# EAGLE design pc_max30001_brk_v1.0 (EAGLE 9.6.2)
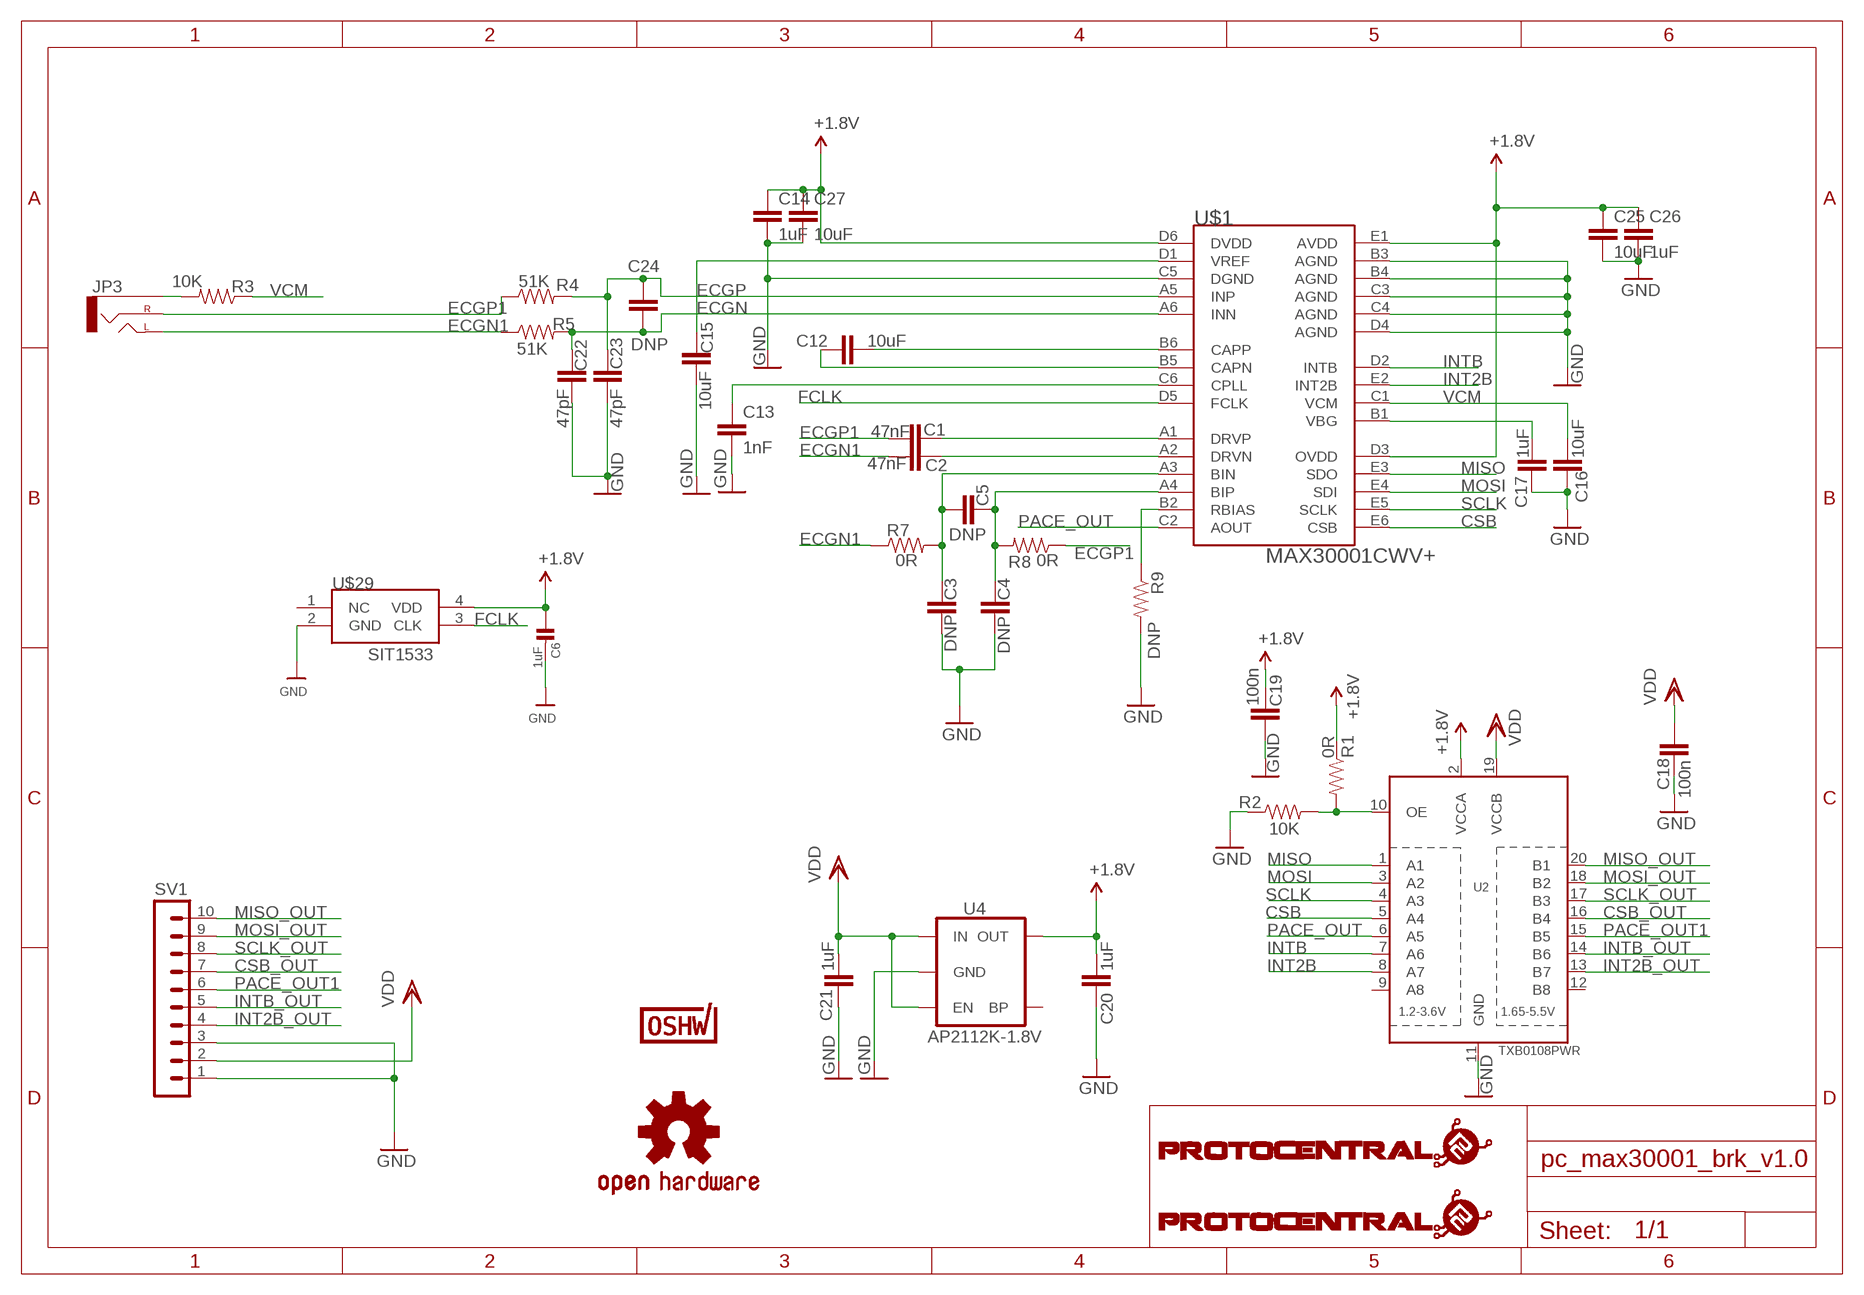
[diagram p0: schematic, sheet 1]

## Parts
C1  47nF  C-EUC0402  [C0402]
C2  47nF  C-EUC0402  [C0402]
C3  DNP  C-EUC0402  [C0402]
C4  DNP  C-EUC0402  [C0402]
C5  DNP  C-EUC0402  [C0402]
C6  1uF  CAP_CERAMIC0402  [0402]
C12  10uF  C-EUC0805  [C0805]
C13  1nF  C-EUC0402  [C0402]
C14  1uF  C-EUC0402  [C0402]
C15  10uF  C-EUC0805  [C0805]
C16  10uF  C-EUC0805  [C0805]
C17  1uF  C-EUC0402  [C0402]
C18  100n  C-EUC0402  [C0402]
C19  100n  C-EUC0402  [C0402]
C20  1uF  C-EUC0805  [C0805]
C21  1uF  C-EUC0805  [C0805]
C22  47pF  C-EUC0402  [C0402]
C23  47pF  C-EUC0402  [C0402]
C24  DNP  C-EUC0402  [C0402]
C25  10uF  C-EUC0805  [C0805]
C26  1uF  C-EUC0402  [C0402]
C27  10uF  C-EUC0805  [C0805]
JP3  AUDIO-JACKSMD2  [AUDIO-JACK-3.5MM-SMD]
R1  0R  RESISTOR0805-RES  [0805]
R2  10K  RESISTOR0805-RES  [0805]
R3  10K  RESISTOR0805-RES  [0805]
R4  51K  RESISTOR0805-RES  [0805]
R5  51K  RESISTOR0805-RES  [0805]
R7  0R  RESISTOR0402-RES  [0402-RES]
R8  0R  RESISTOR0402-RES  [0402-RES]
R9  DNP  RESISTOR0402-RES  [0402-RES]
SV1  MA10-1  [MA10-1]
U2  TXB0108PWR  [TSSOP20]
U4  AP2112K-1.8V  V_REG_LDOSMD  [SOT23-5]
U$1  MAX30001CWV+  [30WLP]
U$3  PROTY-LOGO  [LOGO-PROTY]
U$4  PROTY_LOGO_WITH_TEXT  [PROTY_WITH_TEXT]
U$6  OSHW-LOGOS  [OSHW-LOGO-S]
U$7  CERT-SMALL  [CERT-SMALL-SILK]
U$29  SIT1533  [SIT1533]

## Nets
+1.8V: C6.1 C14.1 C19.2 C20.2 C25.1 C26.1 C27.1 R1.1 U2.2(VCCA) U4.5(OUT) U$1.D3(OVDD) U$1.D6(DVDD) U$1.E1(AVDD) U$29.4(VDD)
CSB: U2.5(A4) U$1.E6(CSB)
CSB_OUT: SV1.7 U2.16(B4)
ECGN: C22.1 C24.2 R5.2 U$1.A6(INN)
ECGN1: C2.1 JP3.TIP(LEFT) R5.1 R7.1
ECGP: C23.1 C24.1 R4.2 U$1.A5(INP)
ECGP1: C1.1 JP3.RING(RIGHT) R4.1 R8.1
FCLK: U$1.D5(FCLK) U$29.3(CLK)
GND: C3.2 C4.2 C6.2 C13.2 C14.2 C15.2 C16.2 C17.2 C18.1 C19.1 C20.1 C21.1 C22.2 C23.2 C25.2 C26.2 C27.2 R2.1 R9.2 SV1.1 SV1.3 U2.11(GND) U4.2(GND) U$1.B3(AGND) U$1.B4(AGND) U$1.C3(AGND) U$1.C4(AGND) U$1.C5(DGND) U$1.D4(AGND) U$29.2(GND)
INT2B: U2.8(A7) U$1.E2(INT2B)
INT2B_OUT: SV1.4 U2.13(B7)
INTB: U2.7(A6) U$1.D2(INTB)
INTB_OUT: SV1.5 U2.14(B6)
MISO: U2.1(A1) U$1.E3(SDO)
MISO_OUT: SV1.10 U2.20(B1)
MOSI: U2.3(A2) U$1.E4(SDI)
MOSI_OUT: SV1.9 U2.18(B2)
N$1: C12.1 U$1.B6(CAPP)
N$2: C1.2 U$1.A1(DRVP)
N$4: C2.2 U$1.A2(DRVN)
N$5: C3.1 C5.1 R7.2 U$1.A3(BIN)
N$6: C4.1 C5.2 R8.2 U$1.A4(BIP)
N$7: R9.1 U$1.B2(RBIAS)
N$10: C13.1 U$1.C6(CPLL)
N$12: C12.2 U$1.B5(CAPN)
N$13: C15.1 U$1.D1(VREF)
N$15: C17.1 U$1.B1(VBG)
N$16: R1.2 R2.2 U2.10(OE)
N$19: JP3.SLEEVE R3.2
PACE_OUT: U2.6(A5) U$1.C2(AOUT)
PACE_OUT1: SV1.6 U2.15(B5)
SCLK: U2.4(A3) U$1.E5(SCLK)
SCLK_OUT: SV1.8 U2.17(B3)
VCM: C16.1 R3.1 U$1.C1(VCM)
VDD: C18.2 C21.2 SV1.2 U2.19(VCCB) U4.1(IN) U4.3(EN)
Unconnected: U2.9(A8) U2.12(B8) U4.4(BP) U$29.1(NC)

## Library data of the parts
C1-C5 C12-C27 = rcl:C-EU: CAPACITOR, European symbol; SPICEPREFIX: C
C6 = microbuilder:CAP_CERAMIC: Ceramic Capacitors 0402 - 0402 Surface Mount Capacitors 16pF 50V 5% [Digikey: 445-4899-2-ND] 18pF 50V 5% [Digikey: 490-1281-2-ND] 22pF 50V 5% [Digikey: 490-1283-2-ND] 68pF 50V 5% [Digikey: 490-1289-2-ND] 0.1uF 10V 10% [Digikey: 490-1318-2-ND] 1.0uF 6.3V 10% [Digikey: 490-1320-2-ND] 0603 - 0603 Surface Mount Capacitors 16 pF 50V 5% [Digikey: 445-5051-2-ND] 22 pF 50V [Digikey: PCC220ACVTR-ND] 33 pF 50V 5% [Digikey: 490-1415-1-ND] 56pF 50V 5% [Digikey: 490-1421-1-ND] 220pF 50V 5% [Digikey: 445-1285-1-ND] 680 pF 50V 2200 pF 50V 5% C0G [Digikey: 445-1297-1-ND] 5600 pF 100V 5% X7R [Digikey: 478-3711-1-ND] 0.1 µF 25V 10% [Digikey: PCC2277TR-ND] 0.22 µF 16V 10% X7R [Digikey: 445-1318-1-ND] 1.0 µF 25V 10% [Digikey: 445-5146-2-ND] 0603 - RF Specific 3pF 250V +/-0.1pF RF [Digikey: 712-1347-1-ND] 18 pF 250V 5% [Digikey: 478-3505-1-ND or 712-1322-1-ND] 56 pF 250V 5% C0G RF [Digikey: 490-4867-1-ND] 68 pF 250V RF [Digikey: 490-4868-1-ND] 0805 - 0805 Surface Mount Capacitors 220 pF 250V 2% RF Ceramic Capacitor [Digikey: 712-1398-1-ND] 1000 pF 50V 2% NP0 Ceramic Capacitor [Digikey: 478-3760-1-ND] 0.1 µF 25V 10% Ceramic Capacitor [Digikey: PCC1828TR-ND] 1.0 µF 16V 10% Ceramic Capacitor[Digikey: 490-1691-2-ND] 10.0 µF 10V 10% Ceramic Capacitor[Digikey: 709-1228-1-ND] 10.0 uF 16V 10% Ceramic Capacitor [Digikey: 478-5165-2-ND] 47 uF 6.3V 20% Ceramic Capacitor [Digikey: 587-1779-1-ND or 399-5506-1-ND] 1206 - 1206 Surface Mount Capacitors 47uF 10V 20% Ceramic Capacitor [Digikey: 490-5528-1-ND or 399-5508-1-ND or 445-6010-1-ND]
JP3 = SparkFun-Connectors:AUDIO-JACK: 3.5mm Audio Jack Simple 3.5mm common PCB mount audio jack. SKU: PRT-08032; PROD_ID: CONN-10353
R1-R5 R7-R9 = SparkFun:RESISTOR: Resistor Basic schematic elements and footprints for 0603, 1206, and PTH resistors.
SV1 = con-lstb:MA10-1: PIN HEADER; OC_FARNELL: unknown; OC_NEWARK: unknown
U2 = adafruit:TXB0108PWR: 8-Bit Bi-Directional Level Shifter 1.2V-3.6V (VCCA) to 1.65V-5.5V (VCCB) bi-directional level shifter with auto direction sensing. Max data rate - VCCA 1.8V: 20Mbps (50ns), VCCA 3.3V: 100Mbps (10ns) Digikey: 296-21527-1-ND
U4 = SparkFun-PowerIC:V_REG_LDO: Voltage Regulator LDO Standard 150mA LDO voltage regulator in SOT-23 layout. Micrel part MIC5205. BP (by-pass) pin is used to lower output noise with 470pF cap.; PROD_ID: VREG-12457
U$1 = circuitects:MAX30001CWV+
U$3 = circuitects:PROTY-LOGO
U$4 = circuitects:PROTY_LOGO_WITH_TEXT
U$6 = SparkFun:OSHW-LOGO: Open Source Hardware Logo This logo indicates the piece of hardware it is found on incorporates a OSHW license and/or adheres to the definition of open source hardware found here: http://freedomdefined.org/OSHW
U$7 = OSHWA:CERT
U$29 = circuitects:SIT1533

## Board
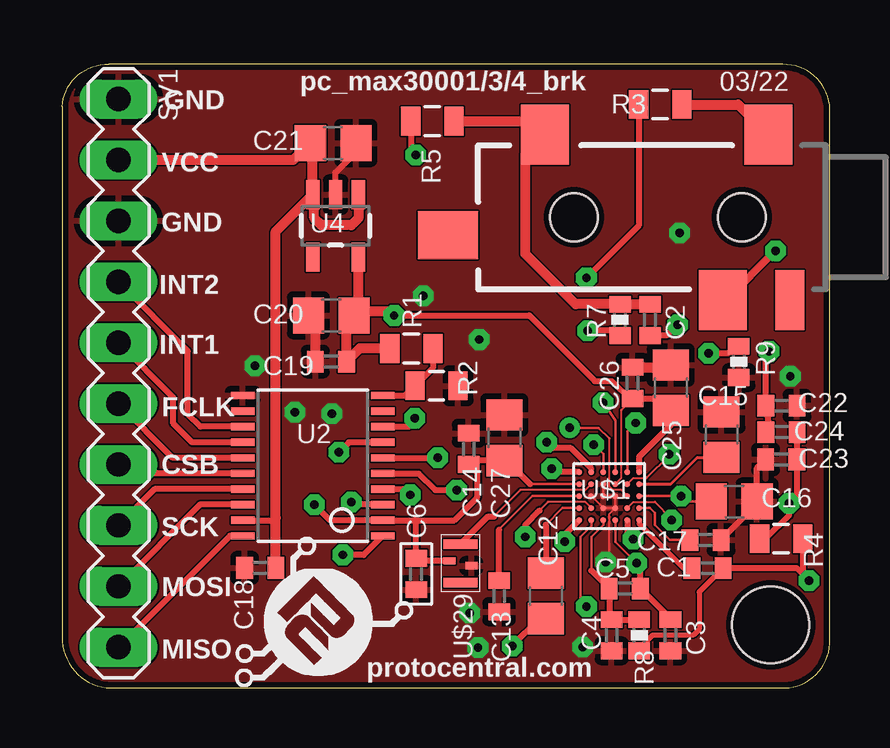
[diagram p1: board, top side]
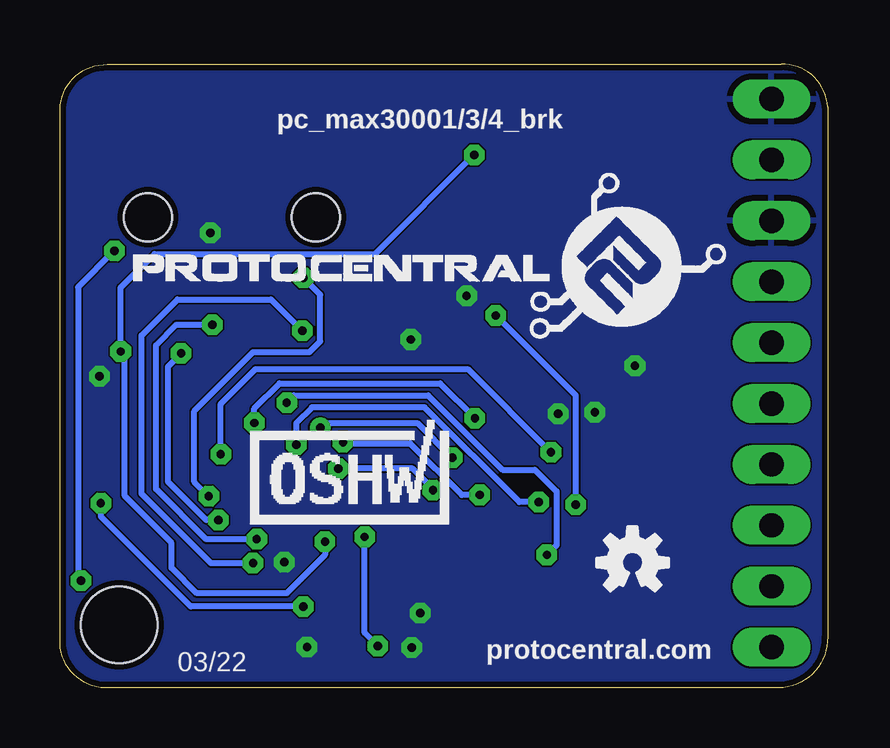
[diagram p2: board, bottom side, seen from below]

Size 32 x 26 mm. Coordinates in mm from the lower left corner, seen from the top.
Outline: 2.03,0 30.13,0 arc90 32,2.03 32,24.13 arc90 30.03,26 1.93,26 arc90 0,24.23 0,2.13 arc90 2.03,0
Copper layers (1*2*15*16): Top 0.035mm / dielectric 1.5mm / Route2 0.035mm / dielectric 0.15mm / Route15 0.035mm / dielectric 0.2mm / Bottom 0.035mm
Design rules "Circuitects-Rules *": minimum track width 2mil, minimum drill 0.05mm, track to track 0.06858125mm, track to pad 0.06858125mm, pad to pad 0.06858125mm, via to via 4mil, smd to smd 4mil, copper to edge 10mil, drill to drill 8mil, minimum pad ring 12mil, minimum via ring 10mil, stop-mask expansion 4mil, vias tented up to drill 25mil, thermal gap 10mil
Holes 3.2 mm at 29.53,2.63

### Footprints (pad centres in the part's own frame; a part is rotated, then mirrored left to right if it is on the bottom)
C0402 = smd 0.7 x 0.9: 1 -0.65,0; 2 0.65,0
0402 = smd 0.7 x 0.9: 1 -0.65,0; 2 0.65,0
C0805 = smd 1.3 x 1.5: 1 -0.95,0; 2 0.95,0
AUDIO-JACK-3.5MM-SMD = smd 2 x 2.5: RING 4.3,3.45; SLEEVE 2.4,-3.45; TIP 11.7,-3.45 | smd 1.2 x 2.5: RSH 1.5,3.45 | smd 2.5 x 2: TSH 15.75,0.75 | hole 2: 3.5,0; 10.5,0
0805 = smd 0.8 x 1.2: 1 -0.9,0; 2 0.9,0
0402-RES = smd 0.7 x 0.9: 1 -0.65,0; 2 0.65,0
MA10-1 = drill 1.016 long: 1 -11.43,0; 2 -8.89,0; 3 -6.35,0; 4 -3.81,0; 5 -1.27,0; 6 1.27,0; 7 3.81,0; 8 6.35,0; 9 8.89,0; 10 11.43,0
TSSOP20 = smd 0.305 x 0.991: 1 -2.925,-2.918; 2 -2.275,-2.918; 3 -1.625,-2.918; 4 -0.975,-2.918; 5 -0.325,-2.918; 6 0.325,-2.918; 7 0.975,-2.918; 8 1.625,-2.918; 9 2.275,-2.918; 10 2.925,-2.918; 11 2.925,2.918; 12 2.275,2.918; 13 1.625,2.918; 14 0.975,2.918; 15 0.325,2.918; 16 -0.325,2.918; 17 -0.975,2.918; 18 -1.625,2.918; 19 -2.275,2.918; 20 -2.925,2.918
SOT23-5 = smd 0.55 x 1.2: 1 -0.95,-1.3; 2 0,-1.3; 3 0.95,-1.3; 4 0.95,1.3; 5 -0.95,1.3
30WLP = smd 0.25 x 0.25: A1 -1.25,1; A2 -0.75,1; A3 -0.25,1; A4 0.25,1; A5 0.75,1; A6 1.25,1; B1 -1.25,0.5; B2 -0.75,0.5; B3 -0.25,0.5; B4 0.25,0.5; B5 0.75,0.5; B6 1.25,0.5; C1 -1.25,0; C2 -0.75,0; C3 -0.25,0; C4 0.25,0; C5 0.75,0; C6 1.25,0; D1 -1.25,-0.5; D2 -0.75,-0.5; D3 -0.25,-0.5; D4 0.25,-0.5; D5 0.75,-0.5; D6 1.25,-0.5; E1 -1.25,-1; E2 -0.75,-1; E3 -0.25,-1; E4 0.25,-1; E5 0.75,-1; E6 1.25,-1
SIT1533 = smd 0.4 x 1.4: 1 -0.8,0; 3 0.8,0 | smd 0.3 x 0.5: 2 -0.1,-0.45; 4 0.1,0.45

### Placement (x,y rotation side)
C1  26.9,5 180 top
C2  24.5,15.35 270 top
C3  25.35,2.2 270 top
C4  22.9,2.2 270 top
C5  23.45,4.15 180 top
C6  14.75,4.75 270 top
C12  20.16,3.84 270 top
C13  18.21,3.83 270 top
C14  16.94,9.97 90 top
C15  27.48,10.56 90 top
C16  28.01,7.77 0 top
C17  26.81,6.17 0 top
C18  8.25,5.01 0 top
C19  11.2,13.61 0 top
C20  11.21,15.53 0 top
C21  11.29,22.72 180 top
C22  29.98,11.77 0 top
C23  29.97,9.53 180 top
C24  29.98,10.67 180 top
C25  25.37,12.52 90 top
C26  23.77,12.72 90 top
C27  18.43,10.43 90 top
JP3  31.83,19.63 180 top
R1  14.55,14.16 0 top
R2  15.6,12.6 180 top
R3  24.93,24.33 0 top
R4  29.97,6.23 180 top
R5  15.43,23.63 180 top
R7  23.25,15.35 270 top
R8  24.05,2.2 90 top
R9  28.2,13.6 270 top
SV1  2.34,13.13 270 top
U2  10.44,9.27 90 top
U4  11.39,19.27 180 top
U$1  22.8,8 180 top
U$3  7.13,-0.07 0 top
U$4  28.93,14.93 0 bottom
U$6  8.13,5.23 0 bottom
U$7  19.93,6.83 0 bottom
U$29  16.6,5.2 90 top

### Tracks (layer width: path | path; a pad name or v marks a point on that pad's centre or on a via)
+1.8V  (via drill 0.35)
  Top 0.076: U$1.D3 23.3,8.75 23.3,11.6
  Top 0.102: U$1.D6 19.5,8.5 | 23.3,11.6 23.7,12 C26.1
  Top 0.254: 19.5,8.5 18.52,9.48 C27.1 | C27.1 17.1,9.48 C14.1 17.3,8.96 17.3,7.95 16.34,7 14.7,7 | C27.1 18.93,9.48 | v13.83,15.53 19.47,15.53 22.2,12.8 22.9,12.8 23.7,12 | C26.1 24.87,12.07 C25.1 25.37,10.97 24.05,9.65 U$1.E1 | v10.5,7.65 11.15,7 U2.2 14.7,7 | U$29.4 14.85,5.3 C6.1 14.75,6.95 14.7,7
  Top 0.406: R1.1 12.4,14.16 C19.2 11.85,15.22 C20.2 12.34,15.71 | 12.34,15.71 13.65,15.71 v13.83,15.53 | 12.34,15.71 U4.5
  Bottom 0.254: v10.5,7.65 10.5,12.2 v13.83,15.53
CSB  (via drill 0.35)
  Top 0.254: U2.5 14.86,8.95 15.55,8.25 v16.45,8.25 | U$1.E6 20.55,9 v20.4,9.15
  Bottom 0.254: v16.45,8.25 16.45,8.3 17.3,9.15 v20.4,9.15
CSB_OUT
  Top 0.254: U2.16 2.71,8.95 SV1.7
ECGN  (via drill 0.35)
  Top 0.254: R5.2 14.53,22.43 v14.73,22.23 | U$1.A6 20.95,6.4 v20.95,6.1 | C24.2 29.47,10.81 C22.1 29.33,13.89 v29.47,14.03
  Bottom 0.254: v14.73,22.22 v14.73,22.23 18.86,18.1 28.06,18.1 29.47,16.69 v29.47,14.03 29.3,13.86 29.3,8 27.35,6.05 27.35,5 26.3,3.95 22.55,3.95 20.95,5.55 v20.95,6.1
ECGN1
  Top 0.406: R5.1 19.58,23.63 JP3.TIP 19.3,22.25 19.3,18.1 21.4,16 R7.1 C2.1
ECGP  (via drill 0.35)
  Top 0.102: U$1.A5 22.05,6.75 21.6,6.3 21.6,3.65 v21.85,3.4
  Top 0.254: C24.1 C23.1 30.62,8.02 v30.3,7.7 30.3,7.2 29.33,6.23 R4.2
  Bottom 0.254: v21.85,3.4 26.55,3.4 30.3,7.15 v30.3,7.7
ECGP1  (via drill 0.35)
  Top 0.2: C1.1 26.55,4 26.55,2.45 26.3,2.2 24.6,2.2 24.05,1.65 R8.1
  Top 0.254: R8.1 24.2,1.7 | 27.4,4.85 C1.1 30.61,5 v31.13,4.48 30.87,4.74 R4.1
  Top 0.305: JP3.RING 27.68,16.18 v29.73,18.23
  Bottom 0.254: v29.73,18.23 31.25,16.71 31.25,4.6 v31.13,4.48
FCLK
  Top 0.076: U$1.D5 21.8,8.25 19.1,8.25
  Top 0.102: 18,7.15 19.1,8.25
  Top 0.254: U$29.3 17.75,7.15 18,7.15
GND  (via drill 0.35)
  Top 0.076: U$1.B3 22.8,7.25 22.8,5.4
  Top 0.102: U$1.D4 U$1.C4 U$1.C3 U$1.B3 | U$1.C5 U$1.B4
  Top 0.134: U$1.B4 U$1.B3
  Top 0.254: U4.2 11.39,21.49 12.24,22.34 C21.1 | C17.2 28.96,7.67 C16.2 28.96,9.17 C23.2 | v22.65,5.25 22.8,5.4
  Top 0.406: C19.1 10.55,15.24 C20.1 | R9.2 28.17,13.08 | C26.2 25.27,13.37 C25.2
  other vias: 8.03,13.43 17.33,1.68 16.98,3.13 11.23,11.43 25.73,18.98 17.38,14.53 15.05,16.35 21.7,1.7 9.7,11.5 30.35,13
  pour Top: 0,26.33 32,26.33 32,0 0,0
  pour Bottom: 0,26 32,26 32,0 0,0
INT2B  (via drill 0.35)
  Top 0.102: U$1.E2 23.55,10.7 v23.9,11.05
  Top 0.254: U2.8 14.45,10.89 v14.7,11.25
  Bottom 0.254: v23.9,11.05 23.9,11.65 22.85,12.7 16.15,12.7 v14.7,11.25
INT2B_OUT
  Top 0.254: U2.13 5.76,10.89 5.23,11.43 5.23,14.05 SV1.4
INTB  (via drill 0.35)
  Top 0.076: U$1.D2 23.8,8.75 24.35,8.75
  Top 0.102: v25.3,9.75 25.3,9.7 24.35,8.75
  Top 0.254: U2.7 11.95,10.24 v11.53,9.83
  Bottom 0.254: v11.53,9.83 15,13.3 23.85,13.3 25.3,11.85 v25.3,9.75
INTB_OUT
  Top 0.254: U2.14 5.42,10.24 4.63,11.03 4.63,12.11 SV1.5
MISO  (via drill 0.35)
  Top 0.102: v22.55,11.9 23.05,11.15 U$1.E3
  Top 0.254: U2.1 12.56,5.55 v11.7,5.55
  Bottom 0.254: v22.55,11.9 22.25,12.2 16.65,12.2 13.55,9.1 12.2,9.1 11.3,8.2 11.3,5.95 v11.7,5.55
MISO_OUT
  Top 0.254: U2.20 6.99,6.34 SV1.10
MOSI  (via drill 0.35)
  Top 0.102: v22.15,10.15 22.55,9.75 U$1.E4
  Top 0.254: U2.3 12.15,7.64 v12.05,7.75
  Bottom 0.254: v12.05,7.75 12.85,7.75 16.8,11.7 21.5,11.7 22.15,11.05 v22.15,10.15
MOSI_OUT
  Top 0.254: U2.18 5.75,7.64 SV1.9
N$1
  Top 0.102: U$1.B6 20.85,7.5 20.16,6.81
  Top 0.254: 20.16,6.81 C12.1
N$2
  Top 0.2: U$1.A1 24.05,6.85 25.9,5 C1.2
N$4  (via drill 0.35)
  Top 0.254: U$1.A2 23.55,6.45 v23.8,6.2 | v25.65,15.15 25.2,14.7 C2.2
  Bottom 0.254: v23.8,6.2 25.9,6.2 28,8.3 28,14.3 27.15,15.15 v25.65,15.15
N$5  (via drill 0.35)
  Top 0.102: U$1.A3 23.05,6.1 v23.95,5.2
  Top 0.254: C3.1 25.35,2.9 C5.1 24.1,5.05 v23.95,5.2 | R7.2 23.05,14.9 v21.9,14.9
  Bottom 0.254: v23.95,5.2 25.7,5.2 28.6,8.1 28.6,14.7 27.1,16.2 23.2,16.2 v21.9,14.9
N$6
  Top 0.102: U$1.A4 22.55,6.8 22.05,6.3 22.05,4.9
  Top 0.254: 22.05,4.9 C5.2 22.8,2.95 C4.1 R8.2
N$7  (via drill 0.35)
  Top 0.076: U$1.B2 23.8,7.75 24.7,7.75
  Top 0.1: U$1.B2 23.6,7.5
  Top 0.102: v25.4,7 25.4,7.05 24.7,7.75
  Top 0.254: R9.1 27.75,13.95 v26.95,13.95
  Bottom 0.254: v25.4,7 25.9,7 27.5,8.6 27.5,13.4 v26.95,13.95
N$10
  Top 0.102: 18.21,6.61 19.6,8 U$1.C6
  Top 0.254: C13.1 18.21,6.61
N$12  (via drill 0.35)
  Top 0.076: U$1.B5 21.8,7.75 20.25,7.75
  Top 0.102: 20.25,7.75 19.9,7.4
  Top 0.254: C12.2 19.89,2.89 v18.75,1.75 | 19.9,7.4 19.3,6.8 v19.3,6.3
  Bottom 0.254: v19.3,6.3 19.3,2.3 v18.75,1.75
N$13
  Top 0.127: U$1.D1 25.37,8.5 26.48,9.61 C15.1
N$15
  Top 0.102: C17.1 25.33,6.17 24.7,6.8 24.7,7.3 24.5,7.5 U$1.B1
N$16
  Top 0.254: U2.10 14.29,12.2 R2.2 15.45,13.35 R1.2
N$19
  Top 0.406: R3.2 28.18,24.33 JP3.SLEEVE
PACE_OUT  (via drill 0.35)
  Top 0.076: U$1.C2 23.3,8.25 22.95,8.25 22.8,8.4 22.8,10.4
  Top 0.102: 22.8,10.4 22.35,10.85 v21.15,10.85
  Top 0.254: U2.6 v15.64,9.6 v15.65,9.6
  Bottom 0.254: v21.15,10.85 20.95,11.05 17.1,11.05 v15.65,9.6
PACE_OUT1
  Top 0.254: U2.15 4.61,9.6 SV1.6
SCLK  (via drill 0.35)
  Top 0.102: U$1.E5 22.05,9.15
  Top 0.254: U2.4 14.26,8.29 v14.5,8.05 | v20.2,10.25 20.45,10 21.2,10 22.05,9.15
  Bottom 0.254: v20.2,10.25 19.85,10.2 17.4,10.2 15.25,8.05 v14.5,8.05
SCLK_OUT
  Top 0.254: U2.17 3.85,8.29 SV1.8
VCM  (via drill 0.35)
  Top 0.102: U$1.C1 v25.8,8 26.03,7.77 C16.1
  Top 0.254: R3.1 24.03,19.28 v21.85,17.1
  Bottom 0.254: v25.8,8 26.4,8.6 26.4,11.55 23.95,14 21.6,14 21.15,14.45 21.15,16.4 v21.85,17.1
VDD
  Top 0.254: U2.19 8.79,7 8.9,7.1
  Top 0.406: U4.3 10.44,22.62 C21.2 9.64,22.02 SV1.2 | C18.2 8.9,7.1 8.9,19.03 U4.3 | U4.1 12.34,19.59 12.05,19.3 10.8,19.3 10.5,19.6 10.5,20.51 U4.3

### Text on the board
tPlace: pc_max30001/3/4_brk | 03/22 | GND | VCC | GND | INT2 | INT1 | FCLK | CSB | SCK | MOSI | MISO | protocentral.com
bPlace: pc_max30001/3/4_brk | protocentral.com | 03/22